# Altium schematic sheet HighSide_Analog_protections.SchDoc: HighSide Analogic Protection
size A4; CheckedBy: Hildo / Joel / Luís; Author: Fellipe; Organization: UNICAMP / LCEE; Address1: University of Campinas - Brazil; Address2: Power Conditioning Laboratory; Address3: Licensed by GNU GPL 3.0; ProjectName: Easy Inverter
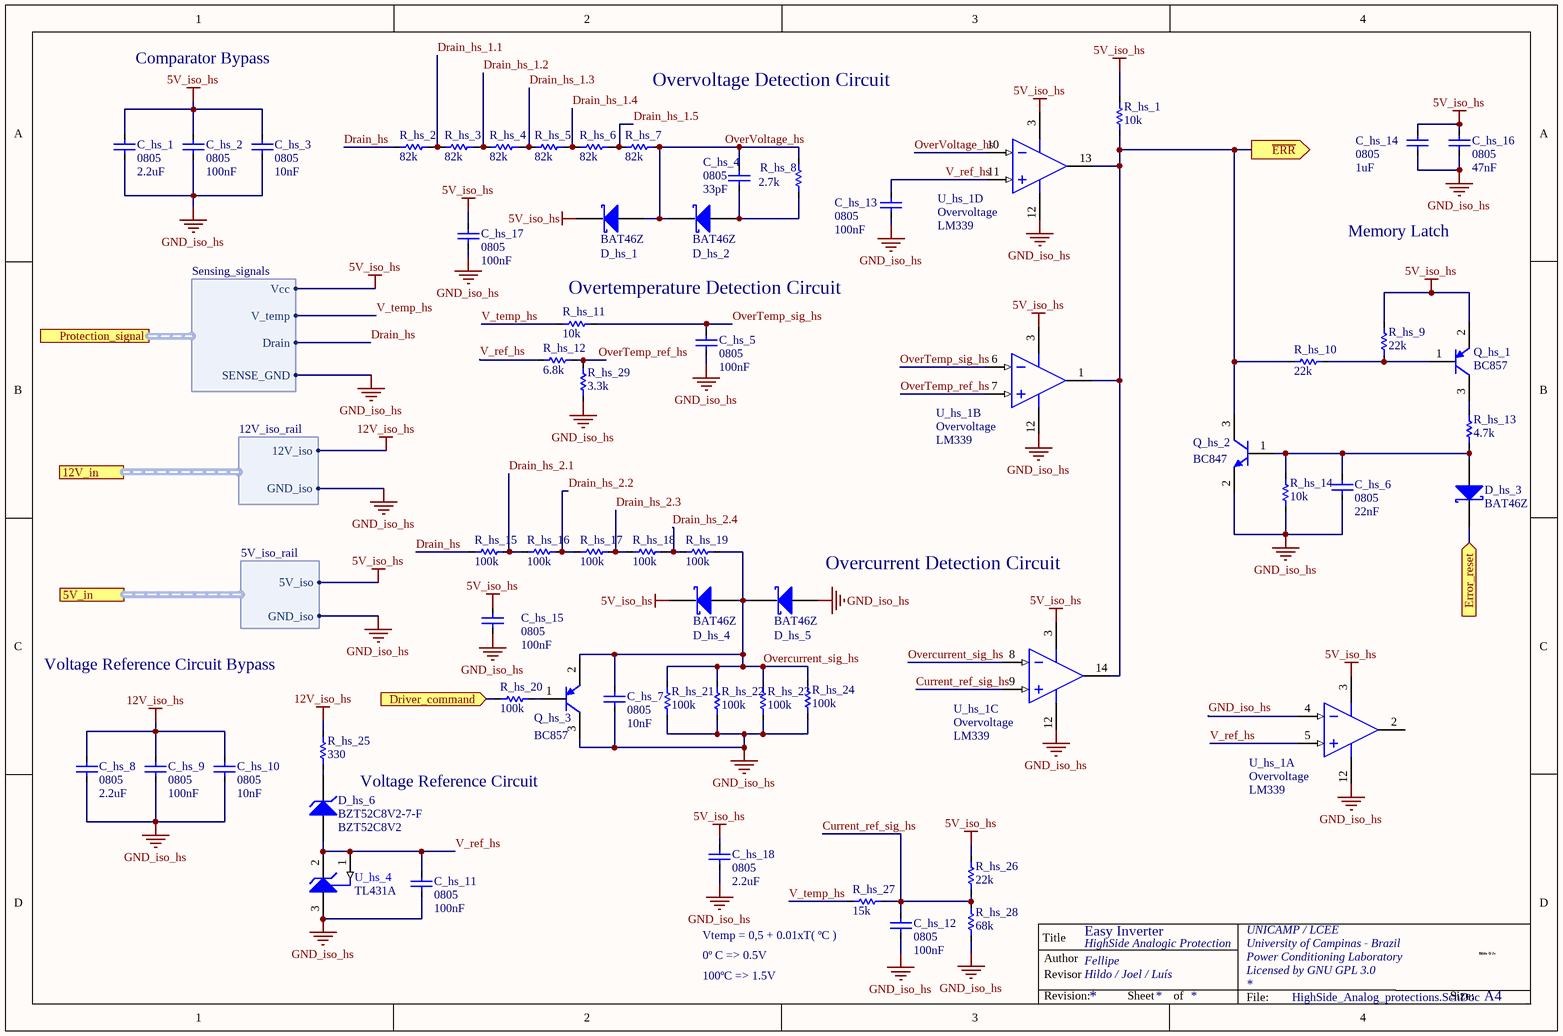
[diagram p0: HighSide_Analog_protections.SchDoc]

## Parts
C_hs_1  0805  value 2.2uF  [Capacitor 0805]
C_hs_2  0805  value 100nF  [Capacitor 0805]
C_hs_3  0805  value 10nF  [Capacitor 0805]
C_hs_4  0805  value 33pF  [Capacitor 0805]
C_hs_5  0805  value 100nF  [Capacitor 0805]
C_hs_6  0805  value 22nF  [Capacitor 0805]
C_hs_7  0805  value 10nF  [Capacitor 0805]
C_hs_8  0805  value 2.2uF  [Capacitor 0805]
C_hs_9  0805  value 100nF  [Capacitor 0805]
C_hs_10  0805  value 10nF  [Capacitor 0805]
C_hs_11  0805  value 100nF  [Capacitor 0805]
C_hs_12  0805  value 100nF  [Capacitor 0805]
C_hs_13  0805  value 100nF  [Capacitor 0805]
C_hs_14  0805  value 1uF  [Capacitor 0805]
C_hs_15  0805  value 100nF  [Capacitor 0805]
C_hs_16  0805  value 47nF  [Capacitor 0805]
C_hs_17  0805  value 100nF  [Capacitor 0805]
C_hs_18  0805  value 2.2uF  [Capacitor 0805]
D_hs_1  BAT46Z  [SOD 123]
D_hs_2  BAT46Z  [SOD 123]
D_hs_3  BAT46Z  [SOD 123]
D_hs_4  BAT46Z  [SOD 123]
D_hs_5  BAT46Z  [SOD 123]
D_hs_6  BZT52C8V2-7-F  value BZT52C8V2  [SOD 123]
Q_hs_1  BC857  [SOT 23]
Q_hs_2  BC847  [SOT 23]
Q_hs_3  BC857  [SOT 23]
R_hs_1  value 10k  [Resistor 0805]  (hidden comment: Resistor 0805)
R_hs_2  value 82k  [Resistor 0805]  (hidden comment: Resistor 0805)
R_hs_3  value 82k  [Resistor 0805]  (hidden comment: Resistor 0805)
R_hs_4  value 82k  [Resistor 0805]  (hidden comment: Resistor 0805)
R_hs_5  value 82k  [Resistor 0805]  (hidden comment: Resistor 0805)
R_hs_6  value 82k  [Resistor 0805]  (hidden comment: Resistor 0805)
R_hs_7  value 82k  [Resistor 0805]  (hidden comment: Resistor 0805)
R_hs_8  value 2.7k  [Resistor 0805]  (hidden comment: Resistor 0805)
R_hs_9  value 22k  [Resistor 0805]  (hidden comment: Resistor 0805)
R_hs_10  value 22k  [Resistor 0805]  (hidden comment: Resistor 0805)
R_hs_11  value 10k  [Resistor 0805]  (hidden comment: Resistor 0805)
R_hs_12  value 6.8k  [Resistor 0805]  (hidden comment: Resistor 0805)
R_hs_13  value 4.7k  [Resistor 0805]  (hidden comment: Resistor 0805)
R_hs_14  value 10k  [Resistor 0805]  (hidden comment: Resistor 0805)
R_hs_15  value 100k  [Resistor 0805]  (hidden comment: Resistor 0805)
R_hs_16  value 100k  [Resistor 0805]  (hidden comment: Resistor 0805)
R_hs_17  value 100k  [Resistor 0805]  (hidden comment: Resistor 0805)
R_hs_18  value 100k  [Resistor 0805]  (hidden comment: Resistor 0805)
R_hs_19  value 100k  [Resistor 0805]  (hidden comment: Resistor 0805)
R_hs_20  value 100k  [Resistor 0805]  (hidden comment: Resistor 0805)
R_hs_21  value 100k  [Resistor 0805]  (hidden comment: Resistor 0805)
R_hs_22  value 100k  [Resistor 0805]  (hidden comment: Resistor 0805)
R_hs_23  value 100k  [Resistor 0805]  (hidden comment: Resistor 0805)
R_hs_24  value 100k  [Resistor 0805]  (hidden comment: Resistor 0805)
R_hs_25  value 330  [Resistor 0805]  (hidden comment: Resistor 0805)
R_hs_26  value 22k  [Resistor 0805]  (hidden comment: Resistor 0805)
R_hs_27  value 15k  [Resistor 0805]  (hidden comment: Resistor 0805)
R_hs_28  value 68k  [Resistor 0805]  (hidden comment: Resistor 0805)
R_hs_29  value 3.3k  [Resistor 0805]  (hidden comment: Resistor 0805)
U_hs_1  Overvoltage  value LM339  [SOIC 14]  (parts A,B,C,D of 4)
U_hs_4  TL431A  [SOT 23]

## Ports
5V_in (harness 5V_iso_rail), 12V_in (harness 12V_iso_rail), Driver_command (in), Error_reset (in), Protection_signal (harness Sensing_signals), ~{ERR} (out)

## Harnesses
5V_iso_rail: GND_iso, 5V_iso
12V_iso_rail: GND_iso, 12V_iso
Sensing_signals: V_temp, Vcc, Drain, SENSE_GND

## Nets
5V_iso_hs: C_hs_1.1 C_hs_2.1 C_hs_3.1 C_hs_14.1 C_hs_15.1 C_hs_16.1 C_hs_17.1 C_hs_18.1 D_hs_1.2(K) D_hs_4.2(K) Q_hs_1.2(E) R_hs_1.2 R_hs_9.2 R_hs_26.2 U_hs_1.3(V+) ; port 5V_in.5V_iso, port Protection_signal.Vcc
12V_iso_hs: C_hs_8.1 C_hs_9.1 C_hs_10.1 R_hs_25.2 ; port 12V_in.12V_iso
GND_iso_hs: C_hs_1.2 C_hs_2.2 C_hs_3.2 C_hs_5.2 C_hs_6.2 C_hs_7.2 C_hs_8.2 C_hs_9.2 C_hs_10.2 C_hs_11.2 C_hs_12.2 C_hs_13.2 C_hs_14.2 C_hs_15.2 C_hs_16.2 C_hs_17.2 C_hs_18.2 D_hs_5.1(A) Q_hs_2.2(E) Q_hs_3.3(C) R_hs_14.1 R_hs_21.1 R_hs_22.1 R_hs_23.1 R_hs_24.1 R_hs_28.1 R_hs_29.1 U_hs_1.4(IN1-) U_hs_1.12(GND) U_hs_4.3(ANODE) ; port 5V_in.GND_iso, port 12V_in.GND_iso, port Protection_signal.SENSE_GND
Current_ref_sig_hs: C_hs_12.1 R_hs_26.1 R_hs_27.2 R_hs_28.2 U_hs_1.9(IN3+)
Drain_hs: R_hs_2.1 R_hs_15.1 ; port Protection_signal.Drain
Drain_hs_1.1: R_hs_2.2 R_hs_3.1
Drain_hs_1.2: R_hs_3.2 R_hs_4.1
Drain_hs_1.3: R_hs_4.2 R_hs_5.1
Drain_hs_1.4: R_hs_5.2 R_hs_6.1
Drain_hs_1.5: R_hs_6.2 R_hs_7.1
Drain_hs_2.1: R_hs_15.2 R_hs_16.1
Drain_hs_2.2: R_hs_16.2 R_hs_17.1
Drain_hs_2.3: R_hs_17.2 R_hs_18.1
Drain_hs_2.4: R_hs_18.2 R_hs_19.1
Driver_command: R_hs_20.2 ; port Driver_command
~{ERR}: Q_hs_2.3(C) R_hs_1.1 R_hs_10.1 U_hs_1.1(OUT2) U_hs_1.13(OUT4) U_hs_1.14(OUT3) ; port ~{ERR}
Error_reset: D_hs_3.2(K) ; port Error_reset
Overcurrent_sig_hs: C_hs_7.1 D_hs_4.1(A) D_hs_5.2(K) Q_hs_3.2(E) R_hs_19.2 R_hs_21.2 R_hs_22.2 R_hs_23.2 R_hs_24.2 U_hs_1.8(IN3-)
OverTemp_ref_hs: R_hs_12.2 R_hs_29.2 U_hs_1.7(IN2+)
OverTemp_sig_hs: C_hs_5.1 R_hs_11.2 U_hs_1.6(IN2-)
OverVoltage_hs: C_hs_4.1 D_hs_1.1(A) D_hs_2.2(K) R_hs_7.2 R_hs_8.2 U_hs_1.10(IN4-)
V_ref_hs: C_hs_11.1 C_hs_13.1 D_hs_6.1(A) R_hs_12.1 U_hs_1.5(IN1+) U_hs_1.11(IN4+) U_hs_4.1(REF) U_hs_4.2(CATHODE)
V_temp_hs: R_hs_11.1 R_hs_27.1 ; port Protection_signal.V_temp
NetC_hs_4_2: C_hs_4.2 D_hs_2.1(A) R_hs_8.1
NetC_hs_6_1: C_hs_6.1 D_hs_3.1(A) Q_hs_2.1(B) R_hs_13.1 R_hs_14.2
NetD_hs_6_2: D_hs_6.2(K) R_hs_25.1
NetQ_hs_1_1: Q_hs_1.1(B) R_hs_9.1 R_hs_10.2
NetQ_hs_1_3: Q_hs_1.3(C) R_hs_13.2
NetQ_hs_3_1: Q_hs_3.1(B) R_hs_20.1

Not connected (* = marked no-connect by the designer): U_hs_1 2(OUT1)

## Notes on the sheet
- Comparator Bypass
- Overvoltage Detection Circuit
- Memory Latch
- Overtemperature Detection Circuit
- (near D_hs_5) Overcurrent Detection Circuit
- Voltage Reference Circuit Bypass
- Voltage Reference Circuit
- Vtemp = 0,5 + 0.01xT( ºC )
- 0º C => 0.5V
- 100ºC => 1.5V
- Title
- Author
- Revisor
- Hildo G Jr
- Revision:
- Sheet
- of
- File:
- Size:
- A4
- HGJr

## Library data of the parts
C_hs_1-C_hs_18 = Capacitor 0805: SMD ceramic capacitor 0805; pn: undefined
  C_hs_1-C_hs_3 C_hs_13: ClassName: comparator_hs
  C_hs_4 C_hs_17: ClassName: overvoltage_circuitry_hs
  C_hs_5: ClassName: overtemperature_circuitry_hs
  C_hs_6 C_hs_14 C_hs_16: ClassName: memory_latch_hs
  C_hs_7 C_hs_12 C_hs_15: ClassName: overcurrent_circuitry_hs
  C_hs_8-C_hs_11: ClassName: voltage_ref_circuitry_hs, Direct_plane_connect
D_hs_1-D_hs_5 = BAT46Z: DIODE SCHOTTKY 100V 150MA SOD123; pn: BAT46ZFILM; Value: BAT46Z
  D_hs_1 D_hs_2: ClassName: overvoltage_circuitry_hs
  D_hs_3: ClassName: memory_latch_hs
  D_hs_4 D_hs_5: ClassName: overcurrent_circuitry_hs
D_hs_6 = BZT52C8V2-7-F: DIODE ZENER 8.2V 500MW SOD123; pn: BZT52C8V2-7-F; ClassName: voltage_ref_circuitry_hs
Q_hs_1 Q_hs_3 = BC857BLT1G: General Purpose Transistor, PNP Silicon, 3-Pin SOT-23, Pb-Free, Tape and Reel; PN: BC857BLT1G; Value: BC857
  Q_hs_1: ClassName: memory_latch_hs
  Q_hs_3: ClassName: overcurrent_circuitry_hs
Q_hs_2 = BC847BLT1G: General Purpose Transistor, NPN Silicon, 3-Pin SOT-23, Pb-Free, Tape and Reel; PN: BC847BLT1G; Value: BC847; ClassName: memory_latch_hs
R_hs_1-R_hs_29 = Resistor 0805: SMD resistor 0805; pn: undefined
  R_hs_1: ClassName: memory_latch_hs; Parameter 1: *
  R_hs_2-R_hs_8: ClassName: overvoltage_circuitry_hs
  R_hs_9 R_hs_10 R_hs_13 R_hs_14: ClassName: memory_latch_hs
  R_hs_11: ClassName: overtemperature_circuitry_hs
  R_hs_15-R_hs_24 R_hs_26-R_hs_28: ClassName: overcurrent_circuitry_hs
  R_hs_25: ClassName: voltage_ref_circuitry_hs, Direct_plane_connect
U_hs_1 = LM339: Low Power Low Offset Voltage Quad Comparator, 14-pin Narrow SOIC; PN: LM339DT; ClassName: comparator_hs
U_hs_4 = TL431A: IC VREF SHUNT ADJ SOT23-3; pn: TL431AMFDT\,215; ComponentLink1Description: Manufacturer URL; ComponentLink1URL: http://www.ti.com/; ComponentLink2Description: Datasheet; ComponentLink2URL: http://www.ti.com/general/docs/lit/getliterature.tsp?genericPartNumber=TL431A&fileType=pdf; Parameter 2: TL431A; ClassName: voltage_ref_circuitry_hs, Direct_plane_connect